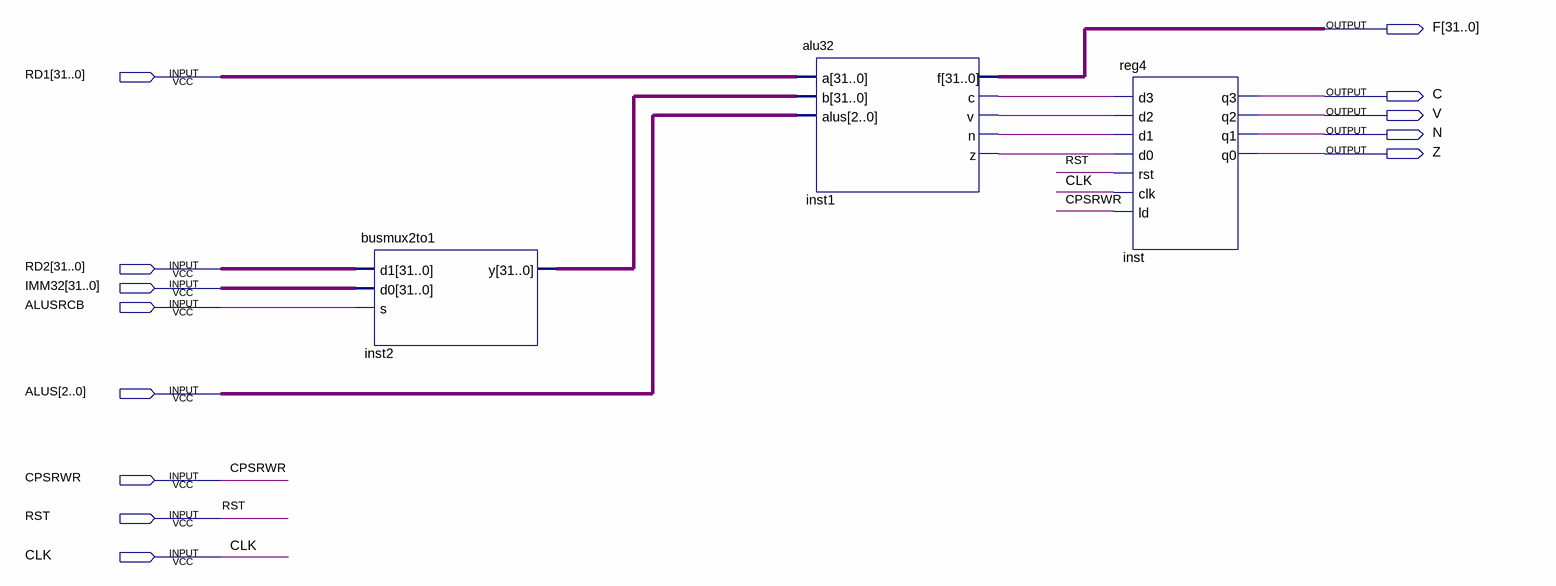
[diagram p0: schematic sheet]
// Quartus schematic execute.bdf as structural Verilog: 3 symbols, 13 pins
module execute (
  input  [31:0] RD1,
  input  [31:0] RD2,
  input  [31:0] IMM32,
  input  ALUSRCB,
  input  [2:0] ALUS,
  input  CPSRWR,
  input  RST,
  input  CLK,
  output [31:0] F,
  output C,
  output V,
  output N,
  output Z
);

  wire inst1_c, inst1_n, inst1_v, inst1_z;
  wire [31:0] inst2_y;

  busmux2to1 inst2 (.d1(RD2), .d0(IMM32), .s(ALUSRCB), .y(inst2_y));
  alu32 inst1 (.a(RD1), .b(inst2_y), .alus(ALUS), .f(F), .c(inst1_c), .v(inst1_v), .n(inst1_n), .z(inst1_z));
  reg4 inst (
    .d3(inst1_c), .d2(inst1_v), .d1(inst1_n), .d0(inst1_z), .rst(RST), .clk(CLK), .ld(CPSRWR), .q3(C),
    .q2(V), .q1(N), .q0(Z));
endmodule
